# Altium project F405_V3.0_Red.PrjPcb
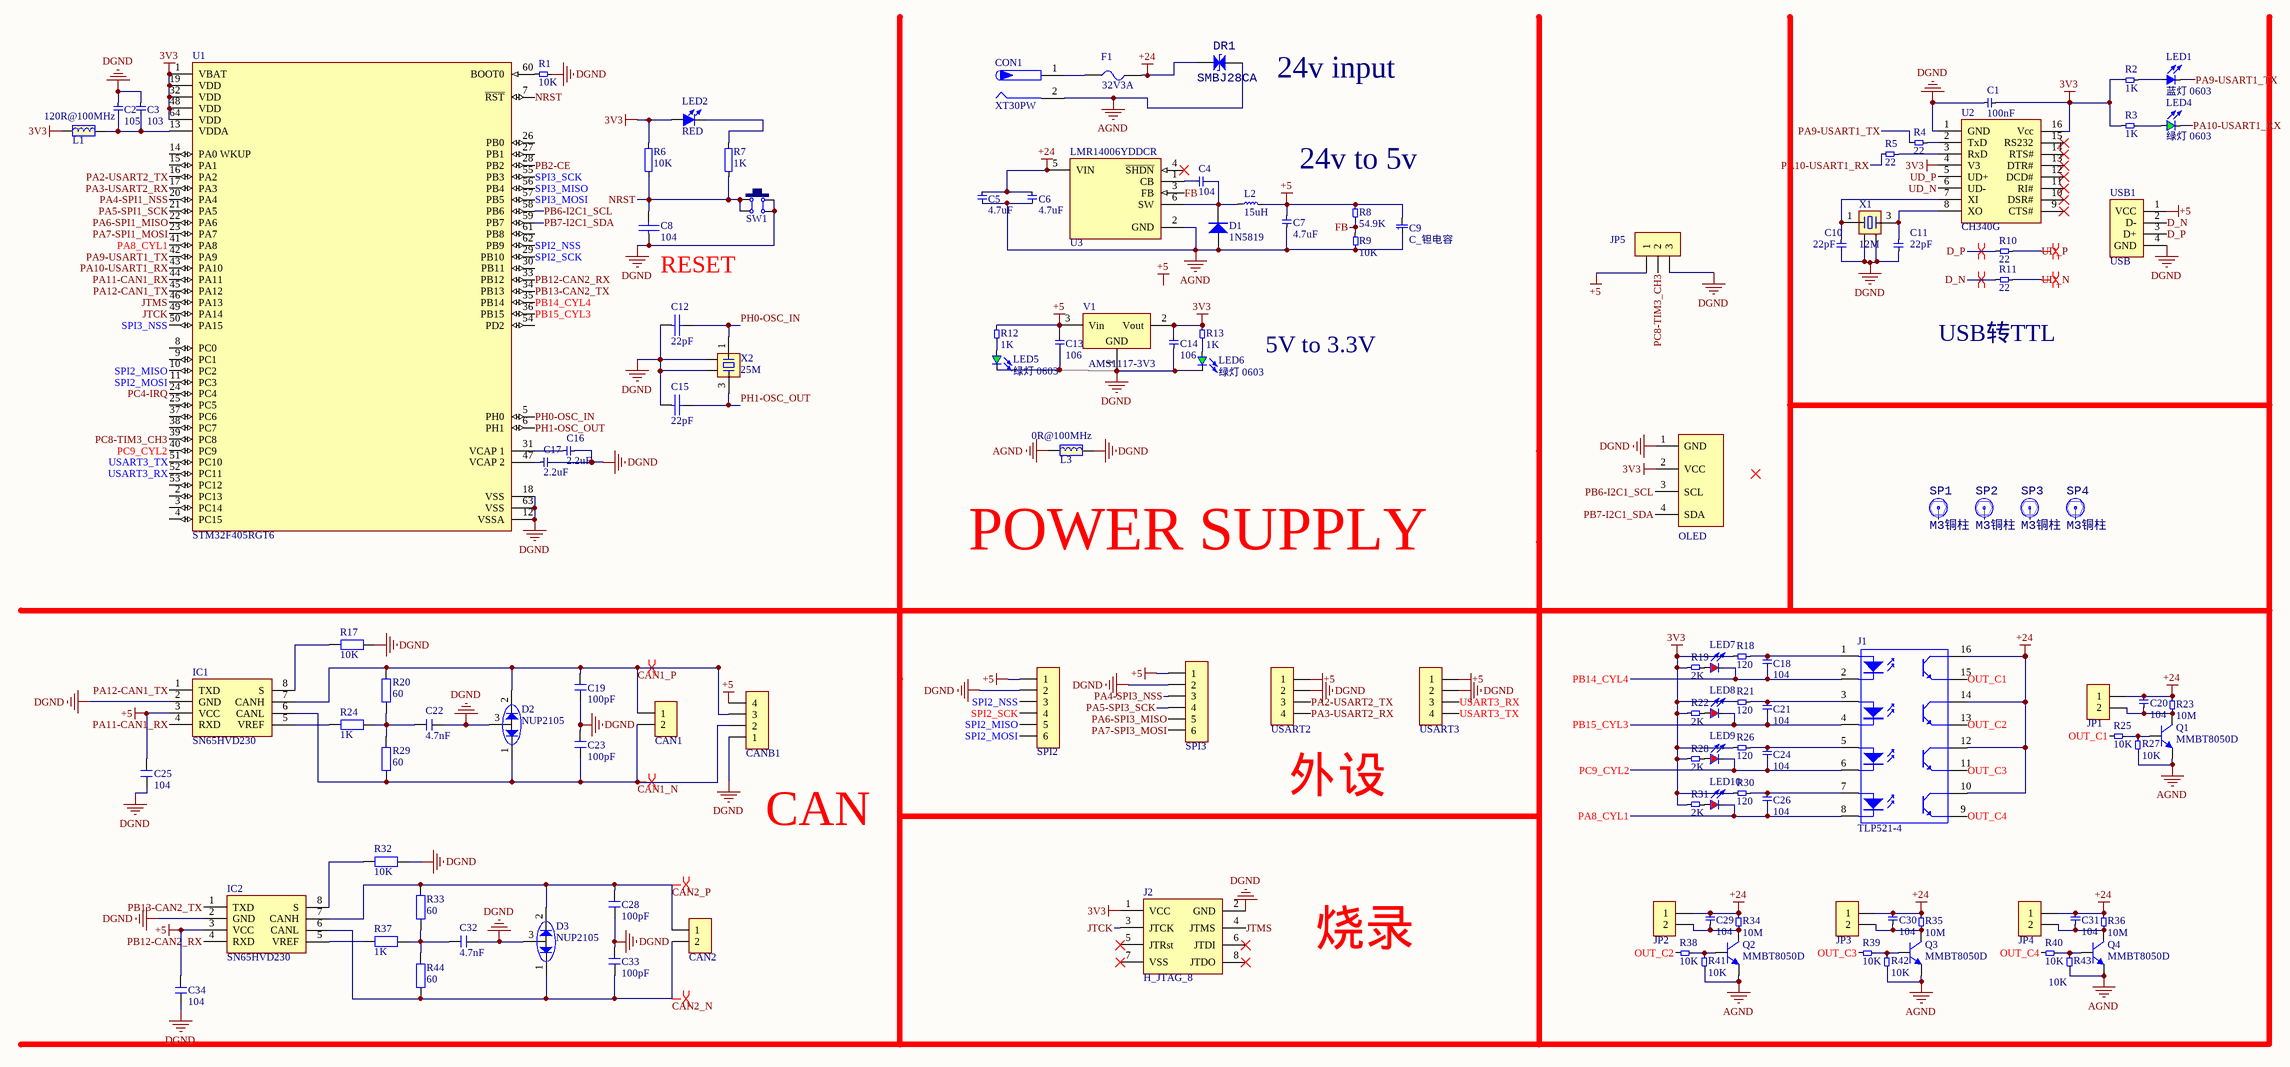
[diagram p0: F405_V3.0_Red.SchDoc]
1 sheet, 125 parts. Net scope: global (net labels, ports and power ports of the same name join across sheets).
Board file: F405_V3.0_Red.PcbDoc

## Sheet F405_V3.0_Red.SchDoc
size A1; SheetNumber: 1; SheetTotal: 1

### Parts
C1  100nF  [C_0603]
C2  105  [C_0603]
C3  103  [C_0603]
C4  104  [C_0603]
C5  4.7uF  [C_0603]
C6  4.7uF  [C_0603]
C7  4.7uF  [C_0603]
C8  104  [C 0603_L]
C9  C_钽电容  [C_T-B_1210/3528-21]
C10  22pF  [C_0603]
C11  22pF  [C_0603]
C12  22pF  [C 0603_L]
C13  106  [C_0603]
C14  106  [C_0603]
C15  22pF  [C 0603_L]
C16  2.2uF  [C_0603]
C17  2.2uF  [C_0603]
C18  104  [C_0603]
C19  100pF  [C 0603_L]
C20  104  [C_0603]
C21  104  [C_0603]
C22  4.7nF  [C 0603_L]
C23  100pF  [C 0603_L]
C24  104  [C_0603]
C25  104  [C 0603_L]
C26  104  [C_0603]
C28  100pF  [C 0603_L]
C29  104  [C_0603]
C30  104  [C_0603]
C31  104  [C_0603]
C32  4.7nF  [C 0603_L]
C33  100pF  [C 0603_L]
C34  104  [C 0603_L]
CAN1  HDR-1X2  [XH2.54-LS-2P]  (value not drawn)
CAN2  HDR-1X2  [XH2.54-LS-2P]  (value not drawn)
CANB1  HDR-1X4  [XH2.54-LS-4P]  (value not drawn)
CON1  XT30PW  [XT30PW-M]
D1  1N5819  [SOD-123]
D2  NUP2105  [SOT23-3N]
D3  NUP2105  [SOT23-3N]
DR1  SMBJ28CA  [SMB]
F1  32V3A  [FU 1206]
IC1  SN65HVD230  [SOP8_M]
IC2  SN65HVD230  [SOP8_M]
J1  TLP521-4  [SOP16N_N]
J2  H_JTAG_8  [IDC2.54-LI-2x4P]
JP1  HDR-1X2  [XH2.54-LS-2P]  (value not drawn)
JP2  HDR-1X2  [XH2.54-LS-2P]  (value not drawn)
JP3  HDR-1X2  [XH2.54-LS-2P]  (value not drawn)
JP4  HDR-1X2  [XH2.54-LS-2P]  (value not drawn)
JP5  HDR-1X3  [XH2.54-LS-3P]  (value not drawn)
L1  120R@100MHz  [L 0603_L]
L2  15uH  [CD43]
L3  0R@100MHz  [L 0603_L]
LED1  蓝灯 0603  [LED_SE]
LED2  RED  [LED 0805R]
LED4  绿灯 0603  [LED_SE]
LED5  绿灯 0603  [LED_SE]
LED6  绿灯 0603  [LED_SE]
LED7  红灯 0603  [LED_SE]  (value not drawn)
LED8  红灯 0603  [LED_SE]  (value not drawn)
LED9  红灯 0603  [LED_SE]  (value not drawn)
LED10  红灯 0603  [LED_SE]  (value not drawn)
OLED  (no value)  [OLED 4Pin 12864]
Q1  MMBT8050D  [SOT23-3N]
Q2  MMBT8050D  [SOT23-3N]
Q3  MMBT8050D  [SOT23-3N]
Q4  MMBT8050D  [SOT23-3N]
R1  10K  [R_0603]
R2  1K  [R_0603]
R3  1K  [R_0603]
R4  22  [R_0603]
R5  22  [R_0603]
R6  10K  [R 0603_L]
R7  1K  [R 0603_L]
R8  54.9K  [R_0603]
R9  10K  [R_0603]
R10  22  [R_0603]
R11  22  [R_0603]
R12  1K  [R_0603]
R13  1K  [R_0603]
R17  10K  [R 0603_L]
R18  120  [R_0603]
R19  2K  [R_0603]
R20  60  [R 0603_L]
R21  120  [R_0603]
R22  2K  [R_0603]
R23  10M  [R_0805]
R24  1K  [R 0603_L]
R25  10K  [R_0603]
R26  120  [R_0603]
R27  10K  [R_0603]
R28  2K  [R_0603]
R29  60  [R 0603_L]
R30  120  [R_0603]
R31  2K  [R_0603]
R32  10K  [R 0603_L]
R33  60  [R 0603_L]
R34  10M  [R_0805]
R35  10M  [R_0805]
R36  10M  [R_0805]
R37  1K  [R 0603_L]
R38  10K  [R_0603]
R39  10K  [R_0603]
R40  10K  [R_0603]
R41  10K  [R_0603]
R42  10K  [R_0603]
R43  10K  [R_0603]
R44  60  [R 0603_L]
SP1  M3铜柱  [M3x4_L]
SP2  M3铜柱  [M3x4_L]
SP3  M3铜柱  [M3x4_L]
SP4  M3铜柱  [M3x4_L]
SPI2  HDR-1X6  [XH2.54-LS-6P]  (value not drawn)
SPI3  HDR-1X6  [XH2.54-LS-6P]  (value not drawn)
SW1  6x6x5  [TSW SMD-6*6*8]  (value not drawn)
U1  STM32F405RGT6  [LQFP64 10x10_N]
U2  CH340G  [SOP16_N]
U3  LMR14006YDDCR  [SOT23-6L]
USART2  HDR-1X4  [XH2.54-LS-4P]  (value not drawn)
USART3  HDR-1X4  [XH2.54-LS-4P]  (value not drawn)
USB1  USB  [USB-A/S_A]
V1  AMS1117-3V3  [SOT223_N]
X1  12M  [OSC 3225-4P]
X2  25M  [OSC 3225-4P]

### Nets
3V3: C1.2 C14.2 J2.1(VCC) L1.1 LED2.1(A) OLED.2(VCC) R2.1 R3.1 R6.2 R13.2 R18.1 R19.2 R21.1 R22.2 R26.1 R28.2 R30.1 R31.2 U1.1(VBAT) U1.19(VDD) U1.32(VDD) U1.48(VDD) U1.64(VDD) U2.4(V3) U2.16(Vcc) V1.2(Vout)
+5: C7.1 C9.2 C13.2 C25.2 C34.2 CANB1.4 IC1.3(VCC) IC2.3(VCC) JP5.1 L2.2 R8.2 R12.2 SPI2.1 SPI3.1 USART2.1 USART3.1 USB1.1(VCC) V1.3(Vin)
+24: C5.2 C6.2 C20.2 C29.2 C30.2 C31.2 DR1.2(K) F1.2 J1.10(4C) J1.12(3C) J1.14(2C) J1.16(1C) JP1.1 JP2.1 JP3.1 JP4.1 R23.2 R34.2 R35.2 R36.2 U3.5(VIN)
AGND: C5.1 C6.1 C7.2 C9.1 CON1.2 D1.1(A) DR1.1(A) L3.1 Q1.2(E) Q2.2(E) Q3.2(E) Q4.2(E) R9.2 R27.1 R41.1 R42.1 R43.1 U3.2(GND)
DGND: C1.1 C2.2 C3.2 C8.1 C10.1 C11.1 C12.1 C13.1 C14.1 C15.1 C16.2 C17.2 C19.2 C22.2 C23.1 C25.1 C28.2 C32.2 C33.1 C34.1 CANB1.1 D2.3 D3.3 IC1.2(GND) IC2.2(GND) J2.2(GND) JP5.3 L3.2 LED5.K LED6.K OLED.1(GND) R1.2 R17.1 R32.1 SPI2.2 SPI3.2 SW1.2 SW1.3 U1.12(VSSA) U1.18(VSS) U1.63(VSS) U2.1(GND) USART2.2 USART3.2 USB1.4(GND) V1.1(GND) X1.2 X1.4 X2.2 X2.4
CAN1_N: C23.2 CAN1.2 CANB1.2 D2.1 IC1.6(CANL) R29.2
CAN1_P: C19.1 CAN1.1 CANB1.3 D2.2 IC1.7(CANH) R20.2
CAN2_N: C33.2 CAN2.2 D3.1 IC2.6(CANL) R44.2
CAN2_P: C28.1 CAN2.1 D3.2 IC2.7(CANH) R33.2
D_N: R11.1 USB1.2(D-)
D_P: R10.1 USB1.3(D+)
FB: R8.1 R9.1 U3.3(FB)
JTCK: J2.3(JTCK) U1.49(PA14)
JTMS: J2.4(JTMS) U1.46(PA13)
NRST: C8.2 R6.1 R7.1 SW1.1 SW1.4 U1.7(~{RST})
OUT_C1: J1.15(1E) R25.1
OUT_C2: J1.13(2E) R38.1
OUT_C3: J1.11(3E) R39.1
OUT_C4: J1.9(4E) R40.1
PA2-USART2_TX: U1.16(PA2) USART2.3
PA3-USART2_RX: U1.17(PA3) USART2.4
PA4-SPI1_NSS: U1.20(PA4)
PA4-SPI3_NSS: SPI3.3
PA5-SPI1_SCK: U1.21(PA5)
PA5-SPI3_SCK: SPI3.4
PA6-SPI1_MISO: U1.22(PA6)
PA6-SPI3_MISO: SPI3.5
PA7-SPI1_MOSI: U1.23(PA7)
PA7-SPI3_MOSI: SPI3.6
PA8_CYL1: C26.1 J1.8(4K) LED10.K U1.41(PA8)
PA9-USART1_TX: LED1.K R4.1 U1.42(PA9)
PA10-USART1_RX: LED4.K R5.1 U1.43(PA10)
PA11-CAN1_RX: IC1.4(RXD) U1.44(PA11)
PA12-CAN1_TX: IC1.1(TXD) U1.45(PA12)
PB2-CE: U1.28(PB2)
PB6-I2C1_SCL: OLED.3(SCL) U1.58(PB6)
PB7-I2C1_SDA: OLED.4(SDA) U1.59(PB7)
PB12-CAN2_RX: IC2.4(RXD) U1.33(PB12)
PB13-CAN2_TX: IC2.1(TXD) U1.34(PB13)
PB14_CYL4: C18.1 J1.2(1K) LED7.K U1.35(PB14)
PB15_CYL3: C21.1 J1.4(2K) LED8.K U1.36(PB15)
PC4-IRQ: U1.24(PC4)
PC8-TIM3_CH3: JP5.2 U1.39(PC8)
PC9_CYL2: C24.1 J1.6(3K) LED9.K U1.40(PC9)
PH0-OSC_IN: C12.2 U1.5(PH0) X2.1
PH1-OSC_OUT: C15.2 U1.6(PH1) X2.3
SPI2_MISO: SPI2.5 U1.10(PC2)
SPI2_MOSI: SPI2.6 U1.11(PC3)
SPI2_NSS: SPI2.3 U1.62(PB9)
SPI2_SCK: SPI2.4 U1.29(PB10)
SPI3_MISO: U1.56(PB4)
SPI3_MOSI: U1.57(PB5)
SPI3_NSS: U1.50(PA15)
SPI3_SCK: U1.55(PB3)
UD_N: R11.2 U2.6(UD-)
UD_P: R10.2 U2.5(UD+)
USART3_RX: U1.52(PC11) USART3.3
USART3_TX: U1.51(PC10) USART3.4
NetC2_1: C2.1 C3.1 L1.2 U1.13(VDDA)
NetC4_1: C4.1 D1.2(K) L2.1 U3.6(SW)
NetC4_2: C4.2 U3.1(CB)
NetC10_2: C10.2 U2.7(XI) X1.1
NetC11_2: C11.2 U2.8(XO) X1.3
NetC16_1: C16.1 U1.31(VCAP_1)
NetC17_1: C17.1 U1.47(VCAP_2)
NetC18_2: C18.2 J1.1(1A) R18.2
NetC20_1: C20.1 JP1.2 Q1.3(C) R23.1
NetC21_2: C21.2 J1.3(2A) R21.2
NetC22_1: C22.1 R20.1 R24.1 R29.1
NetC24_2: C24.2 J1.5(3A) R26.2
NetC26_2: C26.2 J1.7(4A) R30.2
NetC29_1: C29.1 JP2.2 Q2.3(C) R34.1
NetC30_1: C30.1 JP3.2 Q3.3(C) R35.1
NetC31_1: C31.1 JP4.2 Q4.3(C) R36.1
NetC32_1: C32.1 R33.1 R37.1 R44.1
NetCON1_1: CON1.1 F1.1
NetIC1_5: IC1.5(VREF) R24.2
NetIC1_8: IC1.8(S) R17.2
NetIC2_5: IC2.5(VREF) R37.2
NetIC2_8: IC2.8(S) R32.2
NetLED1_A: LED1.A R2.2
NetLED2_2: LED2.2(K) R7.2
NetLED4_A: LED4.A R3.2
NetLED5_A: LED5.A R12.1
NetLED6_A: LED6.A R13.1
NetLED7_A: LED7.A R19.1
NetLED8_A: LED8.A R22.1
NetLED9_A: LED9.A R28.1
NetLED10_A: LED10.A R31.1
NetQ1_1: Q1.1(B) R25.2 R27.2
NetQ2_1: Q2.1(B) R38.2 R41.2
NetQ3_1: Q3.1(B) R39.2 R42.2
NetQ4_1: Q4.1(B) R40.2 R43.2
NetR1_1: R1.1 U1.60(BOOT0)
NetR4_2: R4.2 U2.2(TxD)
NetR5_2: R5.2 U2.3(RxD)

Not connected (* = marked no-connect by the designer): J2 5(JTRst)* 6(JTDI)* 7(VSS)* 8(JTDO)*; SP1 1; SP2 1; SP3 1; SP4 1; U1 2(PC13) 3(PC14) 4(PC15) 8(PC0) 9(PC1) 14(PA0_WKUP) 15(PA1) 25(PC5) 26(PB0) 27(PB1) 30(PB11) 37(PC6) 38(PC7) 53(PC12) 54(PD2) 61(PB8); U2 9(CTS#)* 10(DSR#)* 11(RI#)* 12(DCD#)* 13(DTR#)* 14(RTS#)* 15(RS232)*; U3 4(~{SHDN})*

### Layout directives
differential pair: CAN1_N, CAN1_P, CAN2_N, CAN2_P, D_N, D_P, UD_N, UD_P

### Notes on the sheet
- 24v input
- 24v to 5v
- (near C8) RESET
- 5V to 3.3V
- (near R11) USB转TTL
- POWER SUPPLY
- CAN
- (near USART2) 外设
- 烧录
- Labels drawn without touching a wire or pin: +5
- (in symbol C_钽电容) +

### Library data of the parts
C1-C7 C10 C11 C13 C14 C16-C18 C20 C21 C24 C26 C29-C31 = C_无极贴片: 无极性贴片电容
C8 C12 C15 = 普通电容: Capacitor
C9 = C_钽电容: 有极性贴片钽电容
C19 C22 C23 C25 C28 C32-C34 = C: 无极性贴片电容; 材质: X7R; BOM名称: 无极性贴片电容
CAN1 CAN2 JP1-JP4 = Header 2: 2P接插件; BOM名称: 2P接插件
CANB1 USART2 USART3 = Header 4: 4P接插件; BOM名称: 4P接插件
CON1 = XT30PW-M: XT30PW-M PCB板专用卧式连接器，低温升阻燃插头
D1 = 1N5819: 肖特基二极管; 属性: 40V/2A; BOM名称: 肖特基二极管
D2 D3 = BAT54A: 表贴肖特基二极管; BOM名称: 肖特基二极管; 属性: 30V/0.2A
DR1 = DR: 瞬态电压抑制二极管; BOM名称: 瞬态电压抑制二极管
F1 = FU: 贴片保险丝; BOM名称: 贴片保险丝
IC1 IC2 = SN65HVD1050: CAN芯片; BOM名称: CAN芯片
J1 = TLP521-4: 4路开关光耦; BOM名称: 4路开关光耦
J2 = H_JTAG_8: 调试器; BOM名称: 灯光控制芯片
JP5 = Header 3: 3P接插件; BOM名称: 3P接插件
L1 L3 = L_磁珠: 磁珠
L2 = L_贴片功率: 贴片屏蔽式功率电感
LED1 = 0603 蓝灯: 发光二极管; ComponentLink1Description: 供应商链接; ComponentLink1URL: http://www.szlcsc.com/product/details_73150.html; Package: 0603; Supplier: LC; SuppliersPartNumber: C72041
LED2 = LED-SMD_1W: 大功率LED; BOM名称: 大功率LED
LED4-LED6 = 0603 绿灯: 发光二极管; ComponentLink1Description: 供应商链接; ComponentLink1URL: http://www.szlcsc.com/product/details_73152.html; Package: 0603; Supplier: LC; SuppliersPartNumber: C72043
LED7-LED10 = 0603 红灯: 发光二极管; ComponentLink1Description: 供应商链接; ComponentLink1URL: http://www.szlcsc.com/product/details_2659.html; Package: 0603; Supplier: LC; SuppliersPartNumber: C2286
OLED = OLED: 点阵屏; BOM名称: 12864 点阵屏
Q1-Q4 = MMBTA42: 高压-NPN型; 属性: 300V 0.5A; BOM名称: 高压-NPN型
R1-R5 R8-R13 R18 R19 R21-R23 R25-R28 R30 R31 R34-R36 R38-R43 = R_贴片: 贴片电阻
R6 R7 = 普通电阻
R17 R20 R24 R29 R32 R33 R37 R44 = R: 贴片电阻; BOM名称: 贴片电阻
SP1-SP4 = 铜柱小焊盘: 铜柱; BOM名称: 铜柱
SPI2 SPI3 = Header 6: 6P接插件; BOM名称: 6P接插件
SW1 = TSW SMD-6x6: 贴片6x6轻触开关; BOM名称: 贴片6x6轻触开关
U1 = STM32F405RGT6: ARM Cortex-M4 32b MCU+FPU, 210DMIPS, up to 1MB Flash/192+4KB RAM, USB OTG HS/FS, Ethernet, 17 TIMs, 3 ADCs, 15 comm. interfaces & camera
U2 = CH340G: 串口转USB; BOM名称: 串口转USB
U3 = LMR14006YDDCR: SIMPLE SWITCHER® 4-V to 40-V, 600-mA step-down converter with Low Iq 6-SOT-23-THIN -40 to 125
USB1 = USB-A/S: USB-A型母接口; BOM名称: USB-A型母接口
V1 = AMS1117: 三端稳压芯片; BOM名称: 稳压芯片
X1 X2 = XTAL-4P: 4脚无源晶振; 负载电容: CL20pF; BOM名称: 4脚无源晶振